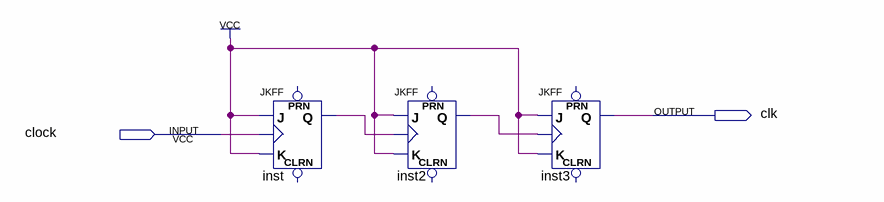
[diagram p0: schematic sheet]
// Quartus schematic divisordefreq.bdf as structural Verilog: 3 symbols, 2 pins
module divisordefreq (
  input  clock,
  output clk
);

  wire inst2_q, inst_q;

  JKFF inst (.K(1'b1), .J(1'b1), .CLK(clock), .Q(inst_q));  // open: PRN, CLRN
  JKFF inst2 (.K(1'b1), .J(1'b1), .CLK(inst_q), .Q(inst2_q));  // open: PRN, CLRN
  JKFF inst3 (.K(1'b1), .J(1'b1), .CLK(inst2_q), .Q(clk));  // open: PRN, CLRN
endmodule
